# Altium schematic sheet SpeakerMixer.SchDoc: Speaker Mixer
size B; Author: Levi Balling; CompanyName: Smart Home; DrawnBy: Levi Balling; Engineer: Levi Balling; Organization: U of U Computer Engineering; Address1: 50 S. Central Campus Dr.; Address2: Rm. 3280 MEB; Address3: Salt Lake City, UT; Address4: Australia 2086; DocumentNumber: 1; Revision: 1; SheetNumber: 13; SheetTotal: 13; Website: www.eng.utah.edu/~lballing/SmartHome; Project: Smart Home; ProjectName: Smart Home
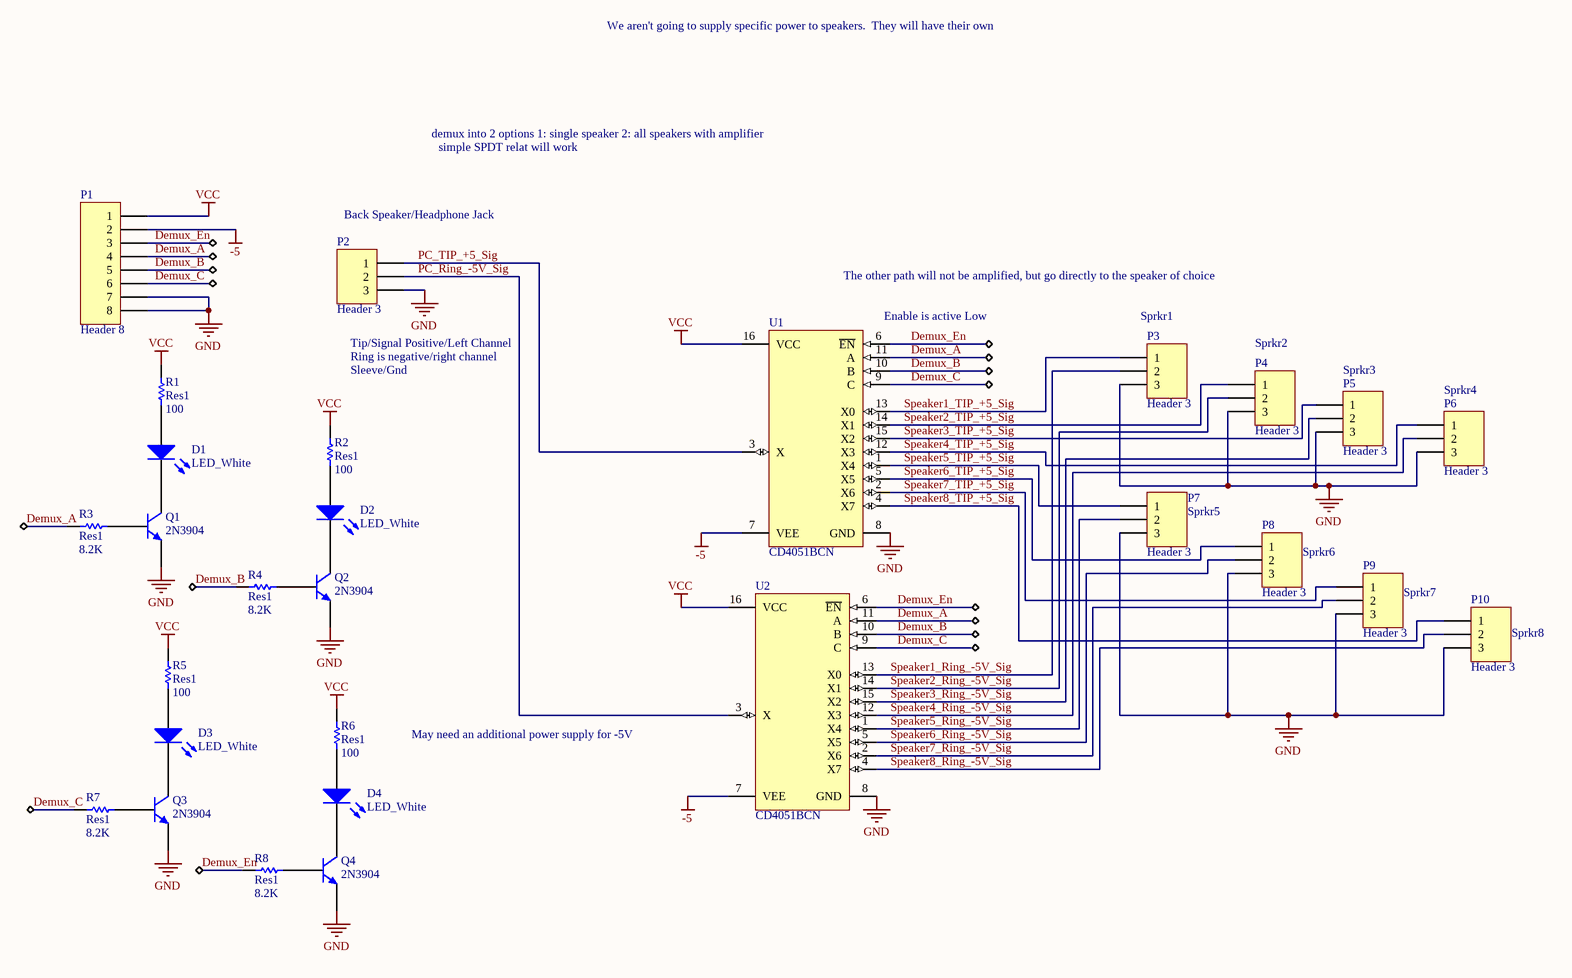
[diagram p0: SpeakerMixer.SchDoc]

## Parts
D1  LED_White  [LED]
D2  LED_White  [LED]
D3  LED_White  [LED]
D4  LED_White  [LED]
P1  Header 8  [HDR1X8]
P2  Header 3  [HDR1X3]
P3  Header 3  [HDR1X3]
P4  Header 3  [HDR1X3]
P5  Header 3  [HDR1X3]
P6  Header 3  [HDR1X3]
P7  Header 3  [HDR1X3]
P8  Header 3  [HDR1X3]
P9  Header 3  [HDR1X3]
P10  Header 3  [HDR1X3]
Q1  2N3904  [2N3904]
Q2  2N3904  [2N3904]
Q3  2N3904  [2N3904]
Q4  2N3904  [2N3904]
R1  Res1  value 100  [AXIAL-0.3]
R2  Res1  value 100  [AXIAL-0.3]
R3  Res1  value 8.2K  [AXIAL-0.3]
R4  Res1  value 8.2K  [AXIAL-0.3]
R5  Res1  value 100  [AXIAL-0.3]
R6  Res1  value 100  [AXIAL-0.3]
R7  Res1  value 8.2K  [AXIAL-0.3]
R8  Res1  value 8.2K  [AXIAL-0.3]
U1  CD4051BCN  [N16E]
U2  CD4051BCN  [N16E]

## Nets
-5: P1.2 U1.7(VEE) U2.7(VEE)
GND: P1.7 P1.8 P2.3 P3.3 P4.3 P5.3 P6.3 P7.3 P8.3 P9.3 P10.3 Q1.1(E) Q2.1(E) Q3.1(E) Q4.1(E) U1.8(GND) U2.8(GND)
VCC: P1.1 R1.1 R2.1 R5.1 R6.1 U1.16(VCC) U2.16(VCC)
Demux_A: P1.4 R3.1 U1.11(A) U2.11(A)
Demux_B: P1.5 R4.1 U1.10(B) U2.10(B)
Demux_C: P1.6 R7.1 U1.9(C) U2.9(C)
Demux_En: P1.3 R8.1 U1.6(~{EN}) U2.6(~{EN})
PC_Ring_-5V_Sig: P2.2 U2.3(X)
PC_TIP_+5_Sig: P2.1 U1.3(X)
Speaker1_Ring_-5V_Sig: P3.2 U2.13(X0)
Speaker1_TIP_+5_Sig: P3.1 U1.13(X0)
Speaker2_Ring_-5V_Sig: P4.2 U2.14(X1)
Speaker2_TIP_+5_Sig: P4.1 U1.14(X1)
Speaker3_Ring_-5V_Sig: P5.2 U2.15(X2)
Speaker3_TIP_+5_Sig: P5.1 U1.15(X2)
Speaker4_Ring_-5V_Sig: P6.2 U2.12(X3)
Speaker4_TIP_+5_Sig: P6.1 U1.12(X3)
Speaker5_Ring_-5V_Sig: P7.2 U2.1(X4)
Speaker5_TIP_+5_Sig: P7.1 U1.1(X4)
Speaker6_Ring_-5V_Sig: P8.2 U2.5(X5)
Speaker6_TIP_+5_Sig: P8.1 U1.5(X5)
Speaker7_Ring_-5V_Sig: P9.2 U2.2(X6)
Speaker7_TIP_+5_Sig: P9.1 U1.2(X6)
Speaker8_Ring_-5V_Sig: P10.2 U2.4(X7)
Speaker8_TIP_+5_Sig: P10.1 U1.4(X7)
NetD1_1: D1.1(A) R1.2
NetD1_2: D1.2(K) Q1.3(C)
NetD2_1: D2.1(A) R2.2
NetD2_2: D2.2(K) Q2.3(C)
NetD3_1: D3.1(A) R5.2
NetD3_2: D3.2(K) Q3.3(C)
NetD4_1: D4.1(A) R6.2
NetD4_2: D4.2(K) Q4.3(C)
NetQ1_2: Q1.2(B) R3.2
NetQ2_2: Q2.2(B) R4.2
NetQ3_2: Q3.2(B) R7.2
NetQ4_2: Q4.2(B) R8.2

## Notes on the sheet
- We aren't going to supply specific power to speakers.  They will have their own
- demux into 2 options 1: single speaker 2: all speakers with amplifier
- simple SPDT relat will work
- (near P2) Back Speaker/Headphone Jack
- The other path will not be amplified, but go directly to the speaker of choice
- (near U1) Enable is active Low
- (near P3) Sprkr1
- (near P2) Tip/Signal Positive/Left Channel
- Ring is negative/right channel
- Sleeve/Gnd
- (near P4) Sprkr2
- (near P5) Sprkr3
- (near P6) Sprkr4
- Sprkr5
- Sprkr6
- Sprkr7
- (near P10) Sprkr8
- May need an additional power supply for -5V
- Date:
- Time:
- Engineer:
- Drawn By:
- Checked By:
- Title
- Size:
- File:
- B
- Number:
- Revision:
- Project:
- Sheet
- of
- Website:

## Library data of the parts
D1-D4 = LED0: Typical INFRARED GaAs LED; Vendor: Taydaelectronics; Value: LED0; Published: 8-Jun-2000; LatestRevisionDate: 08-Jul-2005; LatestRevisionNote: Mech Layer 1 removed.; PackageReference: LED-0; Publisher: Altium Limited; PackageDescription: LED; 2 Leads; Price: 0.04
P1 = Header 8: Header, 8-Pin; Vendor: Taydaelectronics; LatestRevisionDate: 17-Jul-2002; LatestRevisionNote: Re-released for DXP Platform.; Publisher: Altium Limited; Price: 0.08; Value: Header 8
P2-P10 = Header 3: Header, 3-Pin; Vendor: Taydaelectronics; LatestRevisionDate: 17-Jul-2002; LatestRevisionNote: Re-released for DXP Platform.; Publisher: Altium Limited; Price: 0.03; Value: Header 3
Q1-Q4 = 2N3904: NPN General Purpose Amplifier; Vendor: Taydaelectronics; Published: 8-Jun-2000; LatestRevisionDate: 15-Jan-2003; LatestRevisionNote: PCB Footprint 'BCY-W3/D4.7' replaced; DatasheetVersion: 1997; PackageVersion: Sep-1998; PackageReference: TO-92A; Publisher: Altium Limited; PackageDescription: TO, Flat Index; 3 In-Line, Axial Leads; Body Dia. 4.5mm; Leads 0.51 x 0.48 mm (max); ComponentLink1URL: http://www.fairchildsemi.com/; ComponentLink2Description: Datasheet; ComponentLink2URL: http://www.fairchildsemi.com/ds/2N%2F2N3904.pdf; Price: 0.01; Value: 2N3904
R1-R8 = Res1: Resistor; Vendor: Taydaelectronics; Published: 8-Jun-2000; LatestRevisionDate: 17-Jul-2002; LatestRevisionNote: Re-released for DXP Platform.; PackageReference: AXIAL-0.3; Publisher: Altium Limited; PackageDescription: Axial Device, Thru-Hole; 2 Leads; 0.3 in Pin Spacing; Price: 0.01
U1 U2 = CD4051BCN: 8-Channel Analog Multiplexer/Demultiplexer; Vendor: Taydaelectronics; Published: 17-Jul-2002; LatestRevisionDate: 29-May-2009; LatestRevisionNote: Component Body Added.; DatasheetVersion: Jan-1999; PackageVersion: 2000; PackageReference: N16E; Publisher: Altium Limited; PackageDescription: DIP, 16-Pin, Row Spacing 7.62 mm, Pitch 2.54 mm; ComponentLink1URL: http://www.fairchildsemi.com/; ComponentLink2Description: Datasheet; ComponentLink2URL: http://www.fairchildsemi.com/ds/CD%2FCD4052BC.pdf; Price: 0.23; Value: CD4051BCN